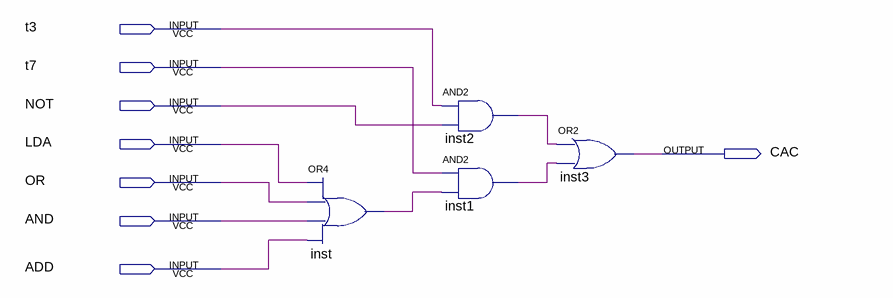
[diagram p0: schematic sheet]
// Quartus schematic CargaAC.bdf as structural Verilog: 4 symbols, 8 pins
module CargaAC (
  input  t3,
  input  t7,
  input  NOT,
  input  LDA,
  input  OR,
  input  AND,
  input  ADD,
  output CAC
);

  wire inst1_out, inst2_out, inst_out;

  or inst (inst_out, LDA, OR, AND, ADD);
  and inst2 (inst2_out, t3, NOT);
  and inst1 (inst1_out, t7, inst_out);
  or inst3 (CAC, inst2_out, inst1_out);
endmodule
